# EAGLE design Base (EAGLE 7.3.0)
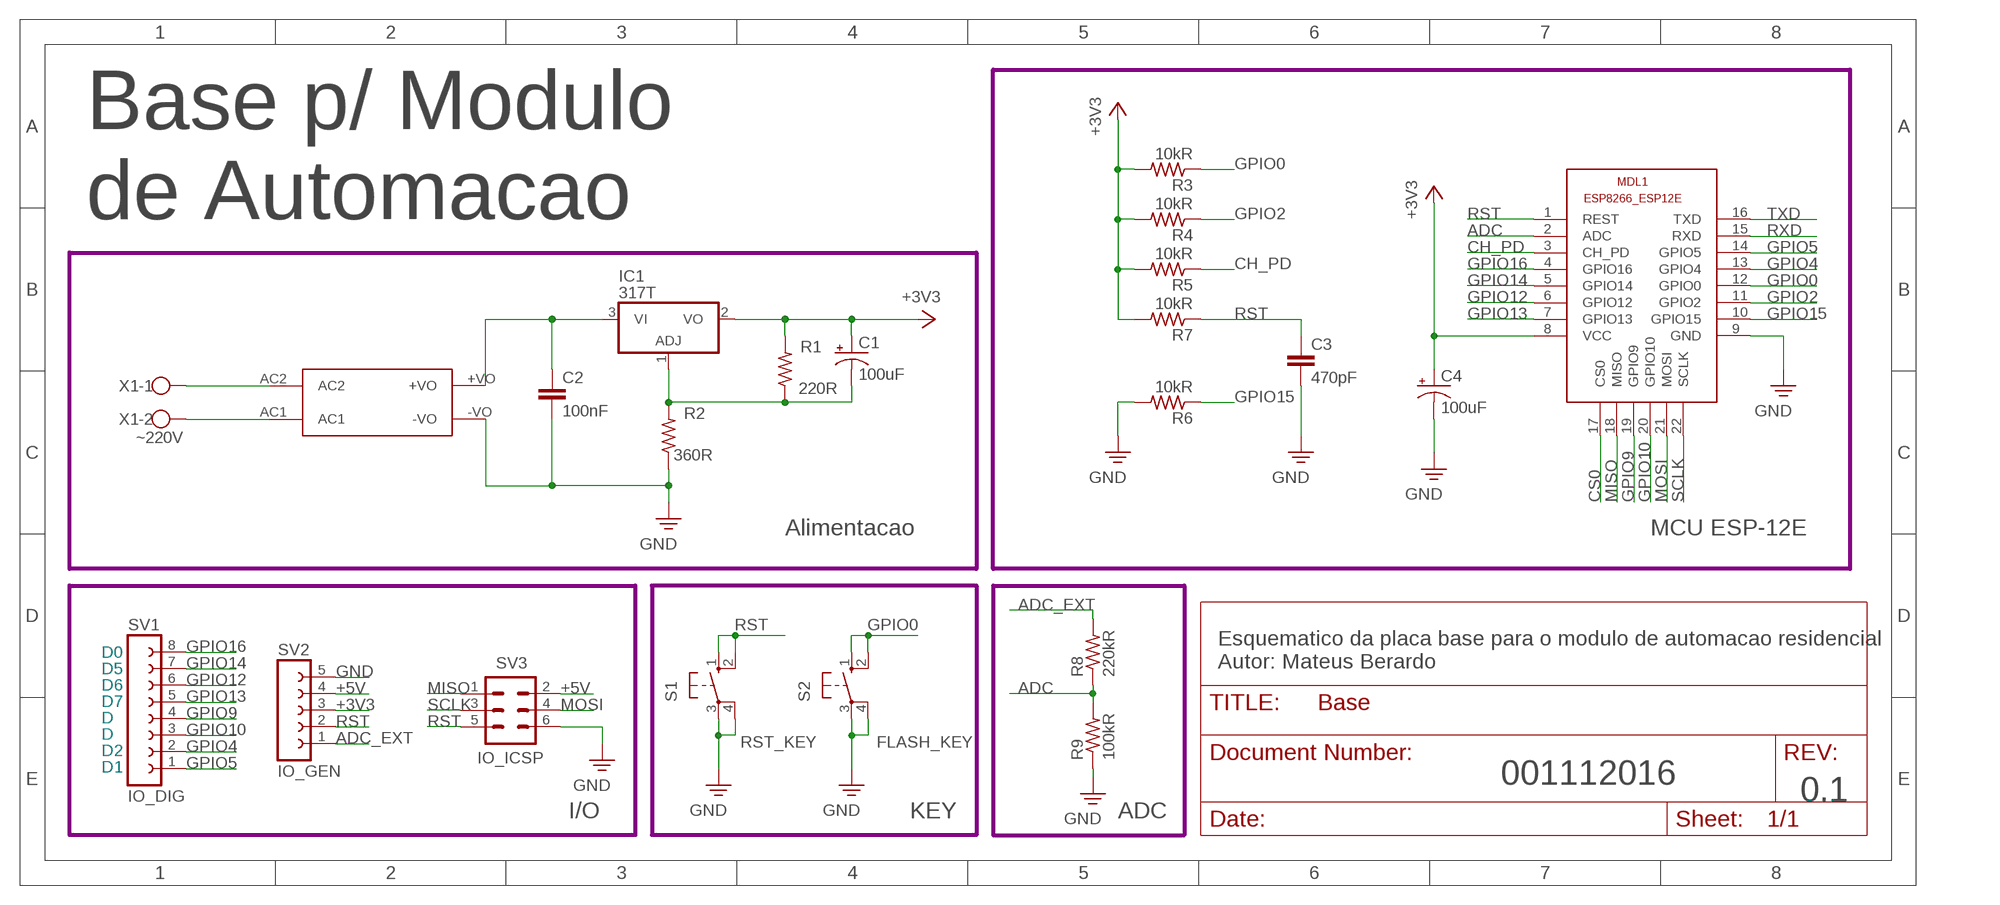
[diagram p0: schematic, sheet 1]

## Parts
C1  100uF  CPOL-USE3.5-8  [E3,5-8]
C2  100nF  C-EU050-055X075  [C050-055X075]
C3  470pF  C-EU050-055X075  [C050-055X075]
C4  100uF  CPOL-USE3.5-8  [E3,5-8]
IC1  317T  [TO220H]
MDL1  MCU ESP  ESP8266-12EESP8266-ESP12E  [ESP8266-ESP12E]
R1  220R  R-US_0207/10  [0207/10]
R2  360R  R-US_0207/10  [0207/10]
R3  10kR  R-US_0207/10  [0207/10]
R4  10kR  R-US_0207/10  [0207/10]
R5  10kR  R-US_0207/10  [0207/10]
R6  10kR  R-US_0207/10  [0207/10]
R7  10kR  R-US_0207/10  [0207/10]
R8  220kR  R-US_0207/10  [0207/10]
R9  100kR  R-US_0207/10  [0207/10]
S1  RST_KEY  10-XX  [B3F-10XX]
S2  FLASH_KEY  10-XX  [B3F-10XX]
SV1  IO_DIG  FE08-1  [FE08]
SV2  IO_GEN  FE05-1  [FE05-1]
SV3  IO_ICSP  MA03-2  [MA03-2]
U$1  HLK-PM01  [HLK-PM01]
X1  ~220V  W237-102  [W237-102]

## Nets
+3V3 [+3V3]: C1.+ C4.+ IC1.2(VO) MDL1.8(VCC) R1.2 R3.2 R4.2 R5.2 R7.2 SV2.3
+5V [+5V]: C2.1 IC1.3(VI) SV2.4 SV3.2 U$1.+VO
+220 [AC]: U$1.AC2 X1.1
-220V [AC]: U$1.AC1 X1.2
ADC: MDL1.2(ADC) R8.1 R9.2
ADC_EXT: R8.2 SV2.1
ADJ [GND]: C1.- IC1.1(ADJ) R1.1 R2.2
CH_PD: MDL1.3(CH_PD) R5.1
CS0: MDL1.17(CS0)
GND [GND]: C2.2 C3.2 C4.- MDL1.9(GND) R2.1 R6.2 R9.1 S1.3(P) S1.4(P1) S2.3(P) S2.4(P1) SV2.5 SV3.6 U$1.-VO
GPIO0: MDL1.12(GPIO0) R3.1 S2.1(S) S2.2(S1)
GPIO2: MDL1.11(GPIO2) R4.1
GPIO4: MDL1.13(GPIO4) SV1.2
GPIO5: MDL1.14(GPIO5) SV1.1
GPIO9: MDL1.19(GPIO9) SV1.4
GPIO10: MDL1.20(GPIO10) SV1.3
GPIO12: MDL1.6(GPIO12) SV1.6
GPIO13: MDL1.7(GPIO13) SV1.5
GPIO14: MDL1.5(GPIO14) SV1.7
GPIO15: MDL1.10(GPIO15) R6.1
GPIO16: MDL1.4(GPIO16) SV1.8
MISO: MDL1.18(MISO) SV3.1
MOSI: MDL1.21(MOSI) SV3.4
RST: C3.1 MDL1.1(REST) R7.1 S1.1(S) S1.2(S1) SV2.2 SV3.5
RXD: MDL1.15(RXD)
SCLK: MDL1.22(SCLK) SV3.3
TXD: MDL1.16(TXD)

## Notes on the sheet
- Base p/ Modulo 
  de Automacao
- Alimentacao | MCU ESP-12E
- D0
- Esquematico da placa base para o modulo de automacao residencial
  Autor: Mateus Berardo
- D5
- D6
- D7
- D
- D
- D2
- D1
- 001112016
- 0.1
- I/O | KEY | ADC

## Library data of the parts
C1 C4 = rcl:CPOL-US: POLARIZED CAPACITOR, American symbol
C2 C3 = rcl:C-EU: CAPACITOR, European symbol
IC1 = linear:*317: Positive VOLTAGE REGULATOR
MDL1 = ESP8266-ESP12E:ESP8266-12E: ESP8266-12E with additional I/O and GPIO04/05 corrected The author cannot warrant that this library is free from error or will meet your specific requirements. Created by PuceBaboon.com. Komagane, Nagano, JAPAN
R1-R9 = resistor:R-US_: RESISTOR, American symbol
S1 S2 = switch-omron:10-XX: OMRON SWITCH; MPN: B3F-1000; OC_FARNELL: 176432; OC_NEWARK: 36M3542
SV1 = con-lsta:FE08-1: FEMALE HEADER; OC_FARNELL: unknown; OC_NEWARK: unknown
SV2 = con-lsta:FE05-1: FEMALE HEADER; OC_FARNELL: unknown; OC_NEWARK: unknown
SV3 = con-lstb:MA03-2: PIN HEADER; OC_FARNELL: unknown; OC_NEWARK: unknown
U$1 = hlk-pm01:HLK-PM01
X1 = con-wago-500:W237-102: WAGO SCREW CLAMP; MPN: 237-102; OC_FARNELL: unknown; OC_NEWARK: 70K9898

## Net classes
0 default: width 1 mm, clearance 0.5 mm
1 GND: width 1.5 mm, clearance 0.5 mm
2 +5V: width 1.5 mm, clearance 0.5 mm
3 +3V3: width 1.5 mm, clearance 0.5 mm
4 signal: width 1 mm, clearance 0.5 mm
5 AC: width 3 mm, clearance 2 mm

## Board
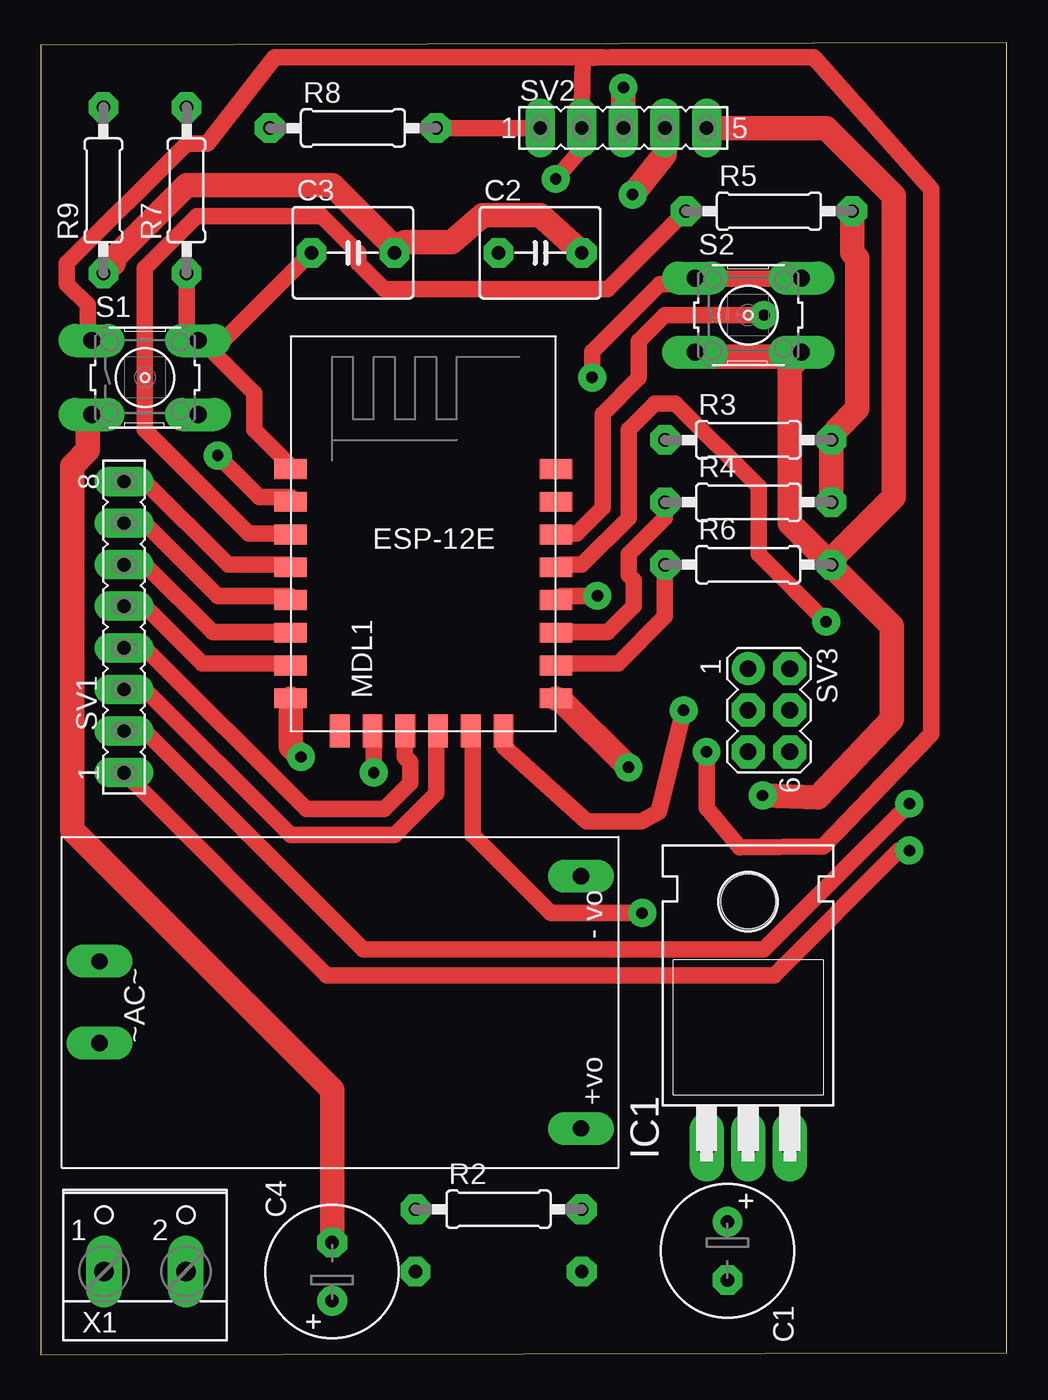
[diagram p1: board, top side]
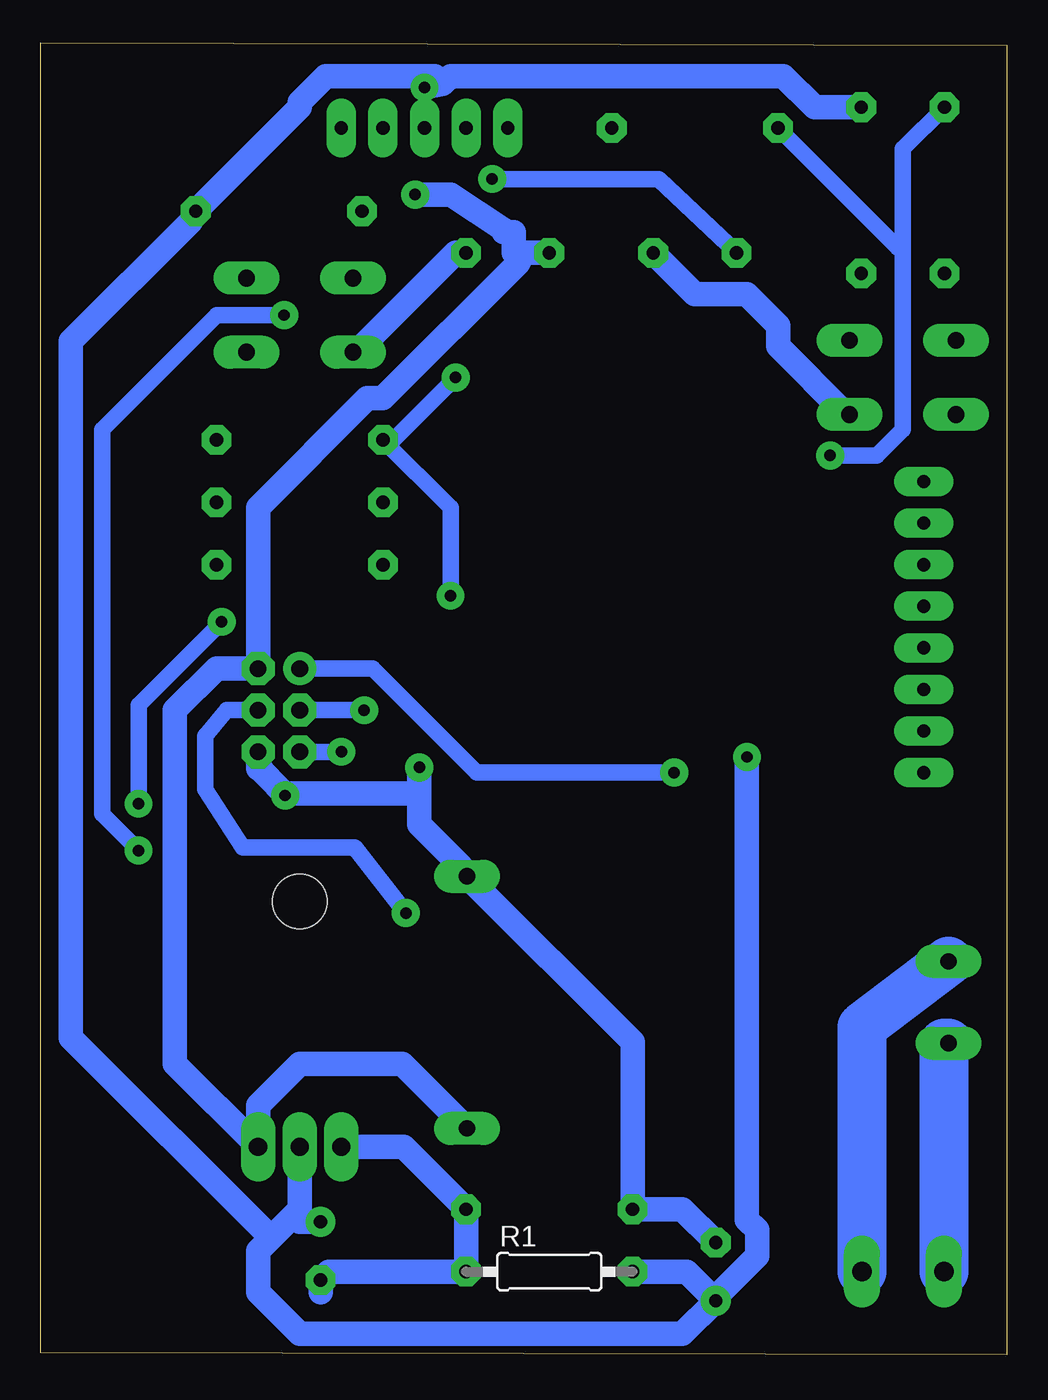
[diagram p2: board, bottom side, seen from below]

Size 58.98 x 80.13 mm. Coordinates in mm from the lower left corner, seen from the top.
Outline: 0,0 58.98,0.13 58.98,80.13 0,80 0,0
Copper layers (1*16): Top 0.035mm / dielectric 1.5mm / Bottom 0.035mm
Design rules "general *": minimum track width 0.6mm, minimum drill 0.7mm, track to track 0.5mm, track to pad 0.6mm, pad to pad 0.2mm, via to via 0.6mm, smd to smd 0.1mm, copper to edge 0.5mm, drill to drill 8mil, minimum pad ring 0.5mm, minimum via ring 0.5mm, stop-mask expansion 4mil, vias tented up to drill 0mil, thermal gap 10mil

### Footprints (pad centres in the part's own frame; a part is rotated, then mirrored left to right if it is on the bottom)
E3,5-8 = drill 0.813 pad 1.6: + -1.778,0 | drill 0.813 pad 1.6 octagon: - 1.778,0
C050-055X075 = drill 0.813 octagon: 1 -2.54,0; 2 2.54,0
TO220H = drill 1.118 long: 1 -2.54,-10.16; 2 0,-10.16; 3 2.54,-10.16 | hole 3.302: 0,4.826
ESP8266-ESP12E = smd 2 x 1.2: 1 -7.62,5.84; 2 -7.62,3.84; 3 -7.62,1.84; 4 -7.62,-0.16; 5 -7.62,-2.16; 6 -7.62,-4.16; 7 -7.62,-6.16; 8 -7.62,-8.16; 9 8.58,-8.16; 10 8.58,-6.16; 11 8.58,-4.16; 12 8.58,-2.16; 13 8.58,-0.16; 14 8.58,1.84; 15 8.58,3.84; 16 8.58,5.84 | smd 1.2 x 2: 17 -4.62,-10.16; 18 -2.62,-10.16; 19 -0.62,-10.16; 20 1.38,-10.16; 21 3.38,-10.16; 22 5.38,-10.16
0207/10 = drill 0.813 octagon: 1 -5.08,0; 2 5.08,0
B3F-10XX = drill 1.016 long: 1 -3.251,2.261; 2 3.251,2.261; 3 -3.251,-2.261; 4 3.251,-2.261
FE08 = drill 0.813 long: 1 -8.89,0; 2 -6.35,0; 3 -3.81,0; 4 -1.27,0; 5 1.27,0; 6 3.81,0; 7 6.35,0; 8 8.89,0
FE05-1 = drill 0.813 long: 1 -5.08,0; 2 -2.54,0; 3 0,0; 4 2.54,0; 5 5.08,0
MA03-2 = drill 1.016: 1 -2.54,-1.27 | drill 1.016 octagon: 2 -2.54,1.27; 3 0,-1.27; 4 0,1.27; 5 2.54,-1.27; 6 2.54,1.27
HLK-PM01 = drill 1 long: +VO 31.7,2.4; -VO 31.7,17.8; AC1 2.3,12.6; AC2 2.3,7.6
W237-102 = drill 1.194 long: 1 -2.5,-1.27; 2 2.5,-1.27

### Placement (x,y rotation side)
C1  41.91,6.35 270 top
C2  30.48,67.31 0 top
C3  19.05,67.31 0 top
C4  17.78,5.08 90 top
IC1  43.18,22.86 0 top
MDL1  22.86,48.26 0 top
R1  27.94,5.08 0 bottom
R2  27.94,8.89 0 top
R3  43.18,55.88 0 top
R4  43.18,52.07 0 top
R5  44.45,69.85 0 top
R6  43.18,48.26 0 top
R7  8.89,71.12 90 top
R8  19.05,74.93 0 top
R9  3.81,71.12 90 top
S1  6.35,59.69 0 top
S2  43.18,63.5 0 top
SV1  5.08,44.45 90 top
SV2  35.56,74.93 0 top
SV3  44.45,39.37 270 top
U$1  1.27,11.43 0 top
X1  6.35,6.35 0 top

### Tracks (layer width: path | path; a pad name or v marks a point on that pad's centre or on a via)
+3V3  (via drill 0.7)
  Top 1.5: MDL1.8 15.24,37.15 v15.88,36.51 | R4.2 R3.2 48.58,56.52 49.85,57.78 49.85,66.99 49.53,67.31 R5.2 | SV2.3 v35.56,77.41
  Bottom 1.5: C4.+ 19.56,5.08 R1.2 | 43.18,8.89 43.18,8.13 C1.+ | 43.18,8.89 IC1.2 | C4.+ 19.81,1.27 43.18,1.27 45.72,3.81 45.72,6.35 44.93,7.14 | 44.93,7.14 43.18,8.89 | v15.88,36.51 15.88,8.26 15.24,7.62 15.24,6.03 17.46,3.81 C4.+ | R7.2 11.75,76.2 13.65,78.11 33.97,78.11 34.45,77.63 | v35.56,77.41 34.45,77.63 | 34.45,77.63 34.92,78.11 41.59,78.11 43.18,76.52 43.18,76.2 R5.2 49.85,69.22 57.15,61.91 57.15,19.37 44.93,7.14
+5V  (via drill 0.7)
  Top 1.5: v36.13,70.87 38.1,73.34 SV2.4
  Bottom 1.5: U$1.+VO 36.92,17.78 43.18,17.78 45.72,15.24 IC1.3 50.8,17.78 50.8,39.37 48.26,41.91 SV3.2 45.72,51.75 39.05,58.42 38.1,58.42 29.84,66.67 29.53,67.31 | 29.53,67.31 C2.1 | 29.53,67.31 30.1,67.31 30.1,68.58 30.73,68.58 30.73,68.71 33.97,70.87 v36.13,70.87
+220
  Bottom 3: U$1.AC2 3.85,19.03 X1.1
-220V
  Bottom 3: U$1.AC1 8.85,20.02 X1.2
ADC  (via drill 0.7)
  Top 1: v10.79,54.93 13.34,52.39 15.24,52.39 MDL1.2
  Bottom 1: v10.79,54.93 7.94,54.93 6.35,56.52 6.35,67.63 | 6.35,67.63 6.35,73.66 R9.2 | R8.1 6.67,67.63 6.35,67.63
ADC_EXT
  Top 1: SV2.1 R8.2
ADJ
  Bottom 1.5: IC1.1 36.83,12.7 R2.2 R1.1 41.4,5.08 C1.- 41.91,3.81
CH_PD
  Top 1: R5.1 34.61,65.09 20.95,65.09 19.37,66.67 19.37,67.31 17.14,69.53 9.53,69.53 6.35,66.36 6.35,56.52 12.7,50.16 15.24,50.16 MDL1.3
GND  (via drill 0.7)
  Top 1.5: R9.1 4.45,66.67 4.45,66.99 8.89,71.44 17.78,71.44 21.59,67.63 C3.2 22.23,67.94 25.08,67.94 26.99,69.6 30.48,69.6 C2.2 | R6.2 45.72,50.8 45.72,60.33 46.35,60.96 S2.4 45.4,60.96 40.01,60.96 S2.3 | SV2.5 47.94,74.93 52.07,70.8 52.07,52.39 48.58,48.9 R6.2 | v35.88,35.88 31.75,40.01 MDL1.9 | C4.- 17.78,16.19 1.91,32.07 1.91,54.29 2.86,55.24 2.86,57.15 S1.3 | v44.07,34.16 47.43,34.04 51.94,38.8 51.94,44.51 48.32,48.13 R6.2
  Bottom 1.5: C4.- 19.81,8.89 R2.1 22.86,19.12 U$1.-VO 33.34,29.84 35.88,32.38 35.88,34.29 | C3.2 19.05,64.77 15.88,64.77 13.97,62.87 13.97,61.59 9.84,57.47 S1.4 | C2.2 33.66,67.31 39.69,61.28 S2.3 | 35.88,34.29 v35.88,35.88 | 35.88,34.29 44.13,34.29 45.72,35.88 SV3.6 45.72,35.81 45.59,35.81 v44.07,34.16
GPIO0  (via drill 0.7)
  Top 1: S2.2 46.35,65.72 40.01,65.72 S2.1 39.69,65.41 37.78,65.41 33.66,61.28 v33.66,59.69 | v33.97,46.35 31.75,46.35 MDL1.12
  Bottom 1: v33.97,46.35 33.97,51.75 R3.1 37.47,55.88 v33.66,59.69
GPIO2
  Top 1: R4.1 38.1,51.12 35.88,48.9 35.88,47.62 36.2,47.31 36.2,45.72 34.61,44.13 31.75,44.13 MDL1.11
GPIO4  (via drill 0.7)
  Top 1: v47.94,44.77 43.81,48.9 43.81,53.02 38.73,58.1 37.47,58.1 35.88,56.52 35.88,51.12 33.02,48.26 31.75,48.26 MDL1.13 | v53.02,33.66 44.13,24.77 19.68,24.77 6.35,38.1 SV1.2
  Bottom 1: v47.94,44.77 53.02,39.69 v53.02,33.66
GPIO5  (via drill 0.7)
  Top 1: v44.13,63.5 38.1,63.5 36.51,61.91 36.51,59.69 34.29,57.47 34.29,51.75 32.7,50.16 31.75,50.16 MDL1.14 | v53.02,30.8 52.39,30.8 44.77,23.18 17.46,23.18 SV1.1
  Bottom 1: v44.13,63.5 48.26,63.5 55.24,56.52 55.24,33.02 v53.02,30.8
GPIO9
  Top 1: SV1.4 6.35,43.18 16.19,33.34 20.95,33.34 22.54,34.92 22.54,36.2 22.23,36.51 22.23,38.1 MDL1.19
GPIO10
  Top 1: SV1.3 6.35,40.64 15.24,31.75 21.59,31.75 24.13,34.29 24.13,38.1 MDL1.20
GPIO12
  Top 1: SV1.6 6.35,48.26 10.48,44.13 15.24,44.13 MDL1.6
GPIO13
  Top 1: SV1.5 6.35,45.72 9.84,42.23 15.24,42.23 MDL1.7
GPIO14
  Top 1: SV1.7 6.35,50.8 10.79,46.35 15.24,46.35 MDL1.5
GPIO15
  Top 1: R6.1 38.1,45.09 35.24,42.23 31.75,42.23 MDL1.10
GPIO16
  Top 1: SV1.8 6.35,53.34 11.43,48.26 15.24,48.26 MDL1.4
MISO  (via drill 0.7)
  Top 1: v20.32,35.56 20.32,38.1 MDL1.18
  Bottom 1: v20.32,35.56 32.38,35.56 38.73,41.91 SV3.1
MOSI  (via drill 0.7)
  Top 1: v36.7,26.99 31.11,26.99 26.35,31.75 26.35,38.1 MDL1.21
  Bottom 1: v36.7,26.99 39.81,30.99 46.67,30.99 48.96,34.54 48.96,37.78 47.62,39.37 SV3.4
RST  (via drill 0.7)
  Top 1: MDL1.1 15.24,54.29 13.02,56.52 13.02,58.74 9.84,61.91 S1.2 | R7.1 8.89,62.55 9.21,62.23 S1.2 | C3.1 10.79,61.59 S1.2 | v31.43,71.82 33.02,73.66 SV2.2 33.02,76.2 33.08,79.18 | 33.08,79.18 34.8,79.25 47.18,79.25 54.36,71.18 54.36,37.91 47.75,31.05 42.67,30.99 40.64,33.4 v40.64,36.83 | S1.1 2.86,62.23 2.86,64.14 1.59,65.41 1.59,66.67 8.89,73.98 10.16,73.98 14.29,79.25 34.29,79.25 33.08,79.18
  Bottom 1: v31.43,71.82 21.27,71.82 C3.1 | v40.64,36.83 SV3.5
SCLK  (via drill 0.7)
  Top 1: v39.24,39.37 37.72,33.15 36.64,32.58 33.34,32.58 28.26,37.15 28.26,38.1 MDL1.22
  Bottom 1: SV3.3 v39.24,39.37